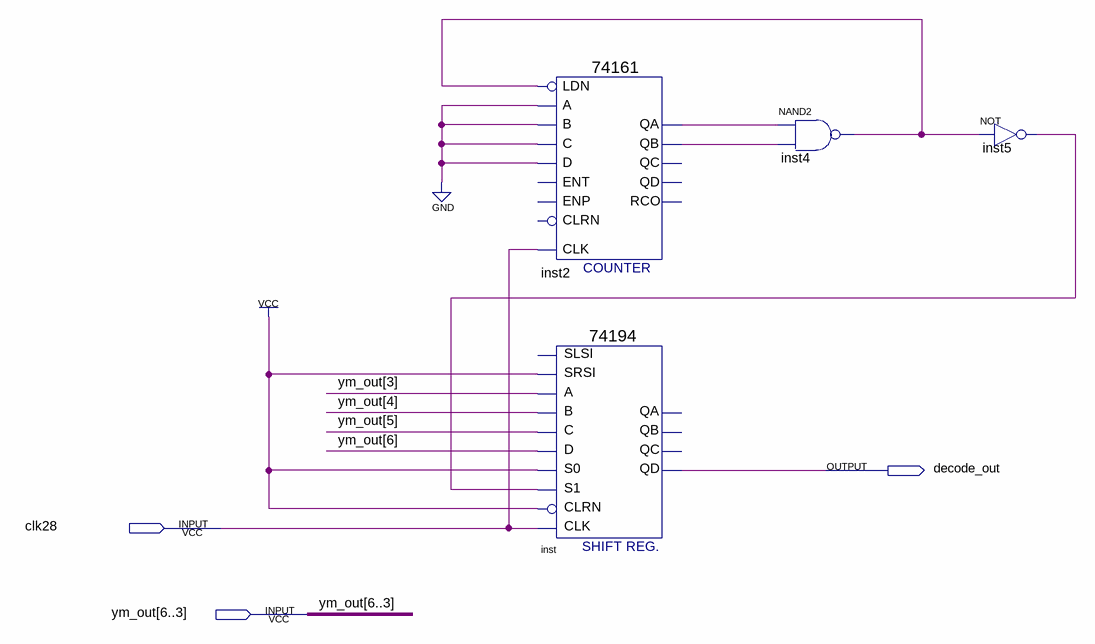
[diagram p0: schematic sheet]
// Quartus schematic bing_to_chuan4.bdf as structural Verilog: 4 symbols, 3 pins
module bing_to_chuan4 (
  input  clk28,
  input  [6:3] ym_out,
  output decode_out
);

  wire inst2_qa, inst2_qb, inst4_out, inst5_out;

  \74161  inst2 (
    .CLK(clk28), .LDN(inst4_out), .A(1'b0), .D(1'b0), .B(1'b0), .C(1'b0), .QB(inst2_qb), .QA(inst2_qa));  // open: CLRN, ENP, ENT, QD, QC, RCO
  \74194  inst (
    .SRSI(1'b1), .B(ym_out[4]), .C(ym_out[5]), .CLK(clk28), .CLRN(1'b1), .D(ym_out[6]), .S1(inst5_out),
    .S0(1'b1), .A(ym_out[3]), .QD(decode_out));  // open: SLSI, QA, QB, QC
  nand inst4 (inst4_out, inst2_qa, inst2_qb);
  not inst5 (inst5_out, inst4_out);
endmodule
